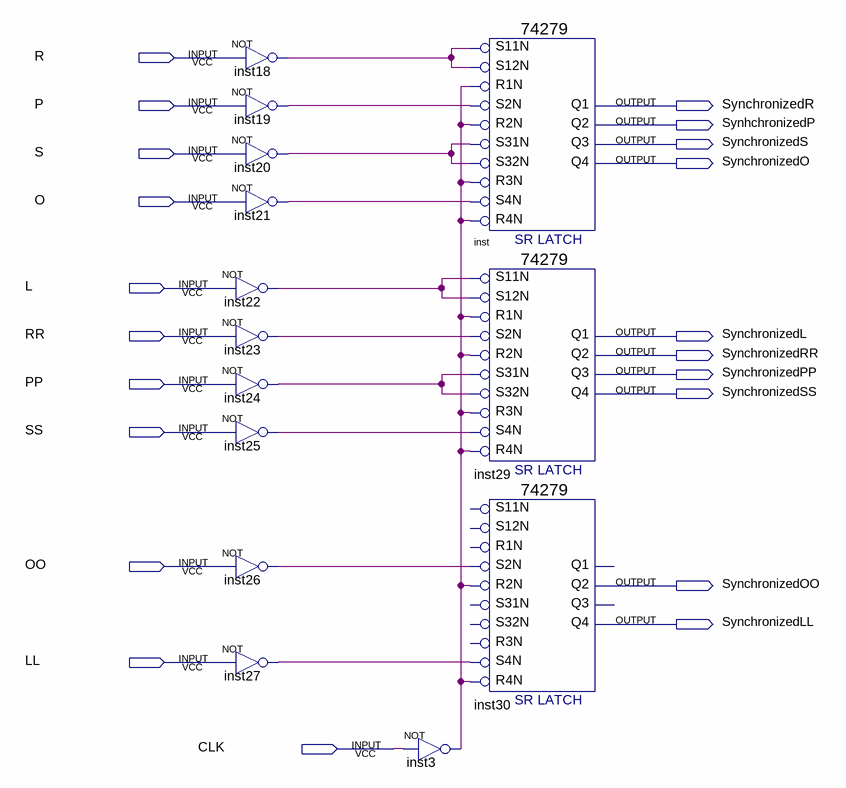
[diagram p0: schematic sheet]
// Quartus schematic levelsensitivesrlatch.bdf as structural Verilog: 14 symbols, 21 pins
module levelsensitivesrlatch (
  input  R,
  input  P,
  input  S,
  input  O,
  input  L,
  input  RR,
  input  PP,
  input  SS,
  input  OO,
  input  LL,
  input  CLK,
  output SynchronizedR,
  output SynhchronizedP,
  output SynchronizedS,
  output SynchronizedO,
  output SynchronizedL,
  output SynchronizedRR,
  output SynchronizedPP,
  output SynchronizedSS,
  output SynchronizedOO,
  output SynchronizedLL
);

  wire inst3_out, inst18_out, inst19_out, inst20_out, inst21_out, inst22_out, inst23_out, inst24_out,
       inst25_out, inst26_out, inst27_out;

  not inst18 (inst18_out, R);
  not inst19 (inst19_out, P);
  not inst20 (inst20_out, S);
  not inst21 (inst21_out, O);
  not inst22 (inst22_out, L);
  not inst23 (inst23_out, RR);
  not inst24 (inst24_out, PP);
  not inst25 (inst25_out, SS);
  not inst26 (inst26_out, OO);
  not inst27 (inst27_out, LL);
  not inst3 (inst3_out, CLK);
  \74279  inst (
    .R1N(inst3_out), .S12N(inst18_out), .S11N(inst18_out), .R2N(inst3_out), .S31N(inst20_out),
    .S32N(inst20_out), .S4N(inst21_out), .R4N(inst3_out), .S2N(inst19_out), .R3N(inst3_out),
    .Q2(SynhchronizedP), .Q1(SynchronizedR), .Q3(SynchronizedS), .Q4(SynchronizedO));
  \74279  inst29 (
    .R1N(inst3_out), .S12N(inst22_out), .S11N(inst22_out), .R2N(inst3_out), .S31N(inst24_out),
    .S32N(inst24_out), .S4N(inst25_out), .R4N(inst3_out), .S2N(inst23_out), .R3N(inst3_out),
    .Q2(SynchronizedRR), .Q1(SynchronizedL), .Q3(SynchronizedPP), .Q4(SynchronizedSS));
  \74279  inst30 (
    .R2N(inst3_out), .S4N(inst27_out), .R4N(inst3_out), .S2N(inst26_out), .Q2(SynchronizedOO),
    .Q4(SynchronizedLL));  // open: R1N, S12N, S11N, S31N, S32N, R3N, Q1, Q3
endmodule
